# Altium project mosfetSwitch.PrjPCB
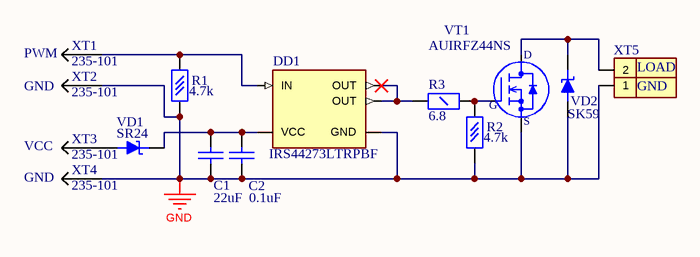
[diagram p0: mosfetSwitch.SchDoc]
1 sheet, 14 parts. Net scope: global (net labels, ports and power ports of the same name join across sheets).
Board file: mosfetSwitch.PcbDoc

## Sheet mosfetSwitch.SchDoc: MOSFET
size 297 x 209 mm; Author: Беляев Д.В.; Address1: Address1; Address2: Address2; Address3: Address3; Address4: Address4; DocumentNumber: АБВГ.123456.001 Э3; SheetNumber: 1; SheetTotal: 1; Scale: 1:1; Title2str: SWITCH; Letter1Column: -; DocumentType: Схема электрическая принципиальная; FirstReferrence: АБВГ.123456.001

### Parts
C1  value 22uF  [1210_CAP]  (hidden comment: C_1210)
C2  value 0.1uF  [0603_CAP]  (hidden comment: C_0603)
DD1  IRS44273LTRPBF  [SOT-23-5]
R1  value 4.7k  [0603_RES]  (hidden comment: R_0603)
R2  value 4.7k  [0603_RES]  (hidden comment: R_0603)
R3  value 6.8  [1206_RES]  (hidden comment: R_1206)
VD1  SR24  [SMA]
VD2  SK59  [SMC]
VT1  AUIRFZ44NS  [D2PACK_TO263]
XT1  235-101  [wago235-101]
XT2  235-101  [wago235-101]
XT3  235-101  [wago235-101]
XT4  235-101  [wago235-101]
XT5  DG500-02P  [DG500-02P]  (value not drawn)

### Nets
GND: C1.1 C2.1 DD1.2(GND) R1.1 R2.1 VD2.1(A) VT1.2(Source) XT2.1 XT4.1 XT5.1
NetC1_2: C1.2 C2.2 DD1.5(VCC) VD1.2(K)
NetDD1_1: DD1.1(IN) R1.2 XT1.1
NetDD1_3: DD1.3(OUT) DD1.4(OUT) R3.1
NetR2_2: R2.2 R3.2 VT1.1(Gate)
NetVD1_1: VD1.1(A) XT3.1
NetVD2_2: VD2.2(K) VT1.3(Drain) XT5.2

### Notes on the sheet
- PWM
- GND
- (near XT5) LOAD
- (near XT5) GND
- VCC
- Подп. и дата
- Инв. № дубл.
- Взам. инв. №
- Разраб.
- Изм.
- Лист
- № докум.
- Подп.
- Дата
- Лит.
- Масса
- Масштаб
- Пров.
- Т.контр.
- Лист:
- Листов:
- Инв. № подл.
- Утв.
- Н.контр.
- 2.106-A4
- Копировал
- Формат А4
- (in symbol AUIRFZ44NS) D; G; S

### Library data of the parts
C1 = C_1210: Конденсатор (1210)
C2 = C_0603: Конденсатор (0603)
DD1 = IRS44273LTRPBF: Single Low-Side Driver IC; Supplier 1: Digi-Key; Supplier Part Number 1: IRS44273LTRPBFCT-ND
R1 R2 = R_0603: Резистор 0.063 Вт (0603)
R3 = R_1206: Резистор 0.25 Вт (1206); Supplier 1: Mouser; Supplier Part Number 1: 71-RCV120610M0FKEA
VD1 = SR24: Диод Шоттки 2А; Package / Case: DO-214AC, SMA; Supplier 1: Newark; Supplier Part Number 1: 19K8489
VD2 = SK59: Диод Шоттки 5А; Supplier 1: Newark; Supplier Part Number 1: 05R5918
VT1 = AUIRFZ44NS: N-chanal Power MOSFET; Supplier 1: Farnell; Supplier Part Number 1: 2062095
XT1-XT4 = wago235-101: 235-101 - 1-CONDUCTOR PCB TERMINAL BLOCK 2 SOLDER PINS / POLE 1 POLE PIN SPACING 3.81 MM / 0.15 IN WITH PUSH BOTTONS; Supplier 1: Newark; Supplier Part Number 1: 28K9170
XT5 = DG500-02P: Terminal block; angled 90; 2.5mm2; 5mm; ways: 2; 24A; 250V; L:15mm; Supplier 1: TME; Supplier Part Number 1: DG500B-5.0-2P14